# Altium schematic sheet [7]-CONNECTORS.SchDoc
size A4
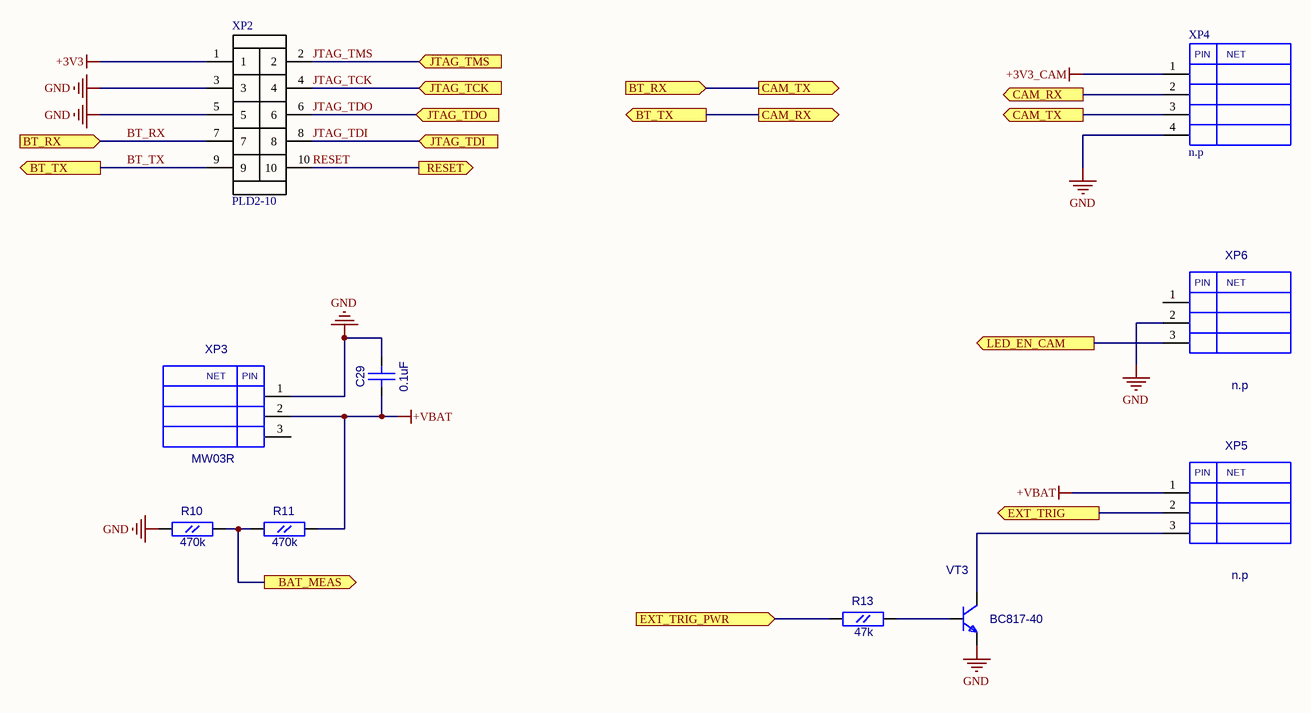
[diagram p0: [7]-CONNECTORS.SchDoc]

## Parts
C29  0.1uF  [CC0603]
R10  470k  [RC0603]
R11  470k  [RC0603]
R13  47k  [RC0603]
VT3  BC817-40  [SOT-23(123)]
XP2  PLD2-10  [PLD2-10]
XP3  MW03R  [MW03R]
XP4  n.p  [PLS2-04]
XP5  n.p  [PLS-03]
XP6  n.p  [PLS2-03]

## Ports
BAT_MEAS (out), BT_RX (in), BT_TX (out), CAM_RX (out), CAM_TX (out), EXT_TRIG (out), EXT_TRIG_PWR (in), JTAG_TCK (in), JTAG_TDI (in), JTAG_TDO (in), JTAG_TMS (in), LED_EN_CAM (out), RESET (out)

## Nets
+3V3: XP2.1
+3V3_CAM: XP4.1
+VBAT: C29.1(A) R11.2(B) XP3.2 XP5.1
GND: C29.2(B) R10.1(A) VT3.2(E) XP2.3 XP2.5 XP3.1 XP4.4 XP6.2
BAT_MEAS: R10.2(B) R11.1(A) ; port BAT_MEAS
BT_RX: XP2.7 XP4.3 ; port BT_RX, port CAM_TX
BT_TX: XP2.9 XP4.2 ; port BT_TX, port CAM_RX
EXT_TRIG: XP5.2 ; port EXT_TRIG
EXT_TRIG_PWR: R13.1(A) ; port EXT_TRIG_PWR
JTAG_TCK: XP2.4 ; port JTAG_TCK
JTAG_TDI: XP2.8 ; port JTAG_TDI
JTAG_TDO: XP2.6 ; port JTAG_TDO
JTAG_TMS: XP2.2 ; port JTAG_TMS
LED_EN_CAM: XP6.3 ; port LED_EN_CAM
RESET: XP2.10 ; port RESET
NetR13_2: R13.2(B) VT3.1(B)
NetVT3_3: VT3.3(C) XP5.3

Not connected (* = marked no-connect by the designer): XP3 3; XP6 1

## Notes on the sheet
- (in symbol MW03R) NET; PIN
- (in symbol PLS2-03) PIN; NET
- (in symbol PLS2-04) PIN; NET
- (in symbol PLS03) PIN; NET

## Library data of the parts
C29 = CC0603: Value: 0.1uF
R10 R11 R13 = RC0603
  R10 R11: Value: 470k
  R13: Value: 47k
VT3 = BC846BLT1: NPN 500ma transistor; ComponentField7: Published 29-Sep-2000; OriginalName: BC846BLT1; Value: BC817-40
XP4 = PLS2-04: Value: n.p
XP5 = PLS03: Value: *
XP6 = PLS2-03: Value: n.p
XP2 = PLD2-10: Value: PLD2-10
XP3 = MW03R: Value: *